# Altium schematic sheet relay.SchDoc
size A4
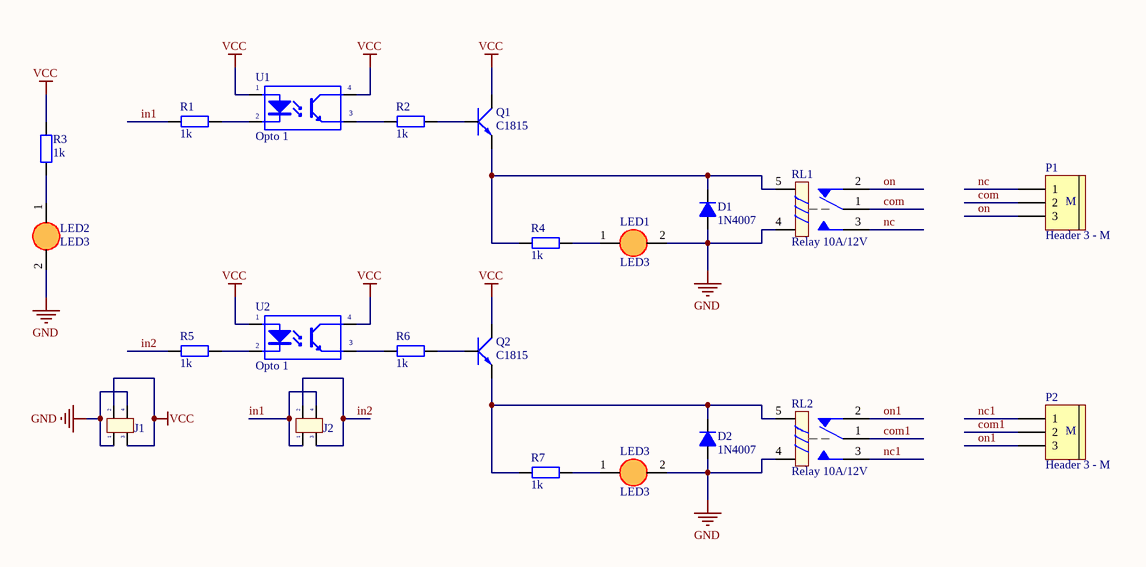
[diagram p0: relay.SchDoc]

## Parts
D1  1N4007  [D1A]
D2  1N4007  [D1A]
J1  Jumper 2x2  [JP2X2]  (value not drawn)
J2  Jumper 2x2  [JP2X2]  (value not drawn)
LED1  LED3  [LED3mm]
LED2  LED3  [LED3mm]
LED3  LED3  [LED3mm]
P1  Header 3 - M  [Medium - Header 3]
P2  Header 3 - M  [Medium - Header 3]
Q1  C1815  [QTO-92]
Q2  C1815  [QTO-92]
R1  1k  [R1/4W]
R2  1k  [R1/4W]
R3  1k  [R1/4W]
R4  1k  [R1/4W]
R5  1k  [R1/4W]
R6  1k  [R1/4W]
R7  1k  [R1/4W]
RL1  Relay 10A/12V  [RL_SPDT_10A]
RL2  Relay 10A/12V  [RL_SPDT_10A]
U1  Opto 1  [DIP4]
U2  Opto 1  [DIP4]

## Nets
GND: D1.1(A) D2.1(A) J1.1 J1.4 LED1.2(K) LED2.2(K) LED3.2(K) RL1.4 RL2.4
VCC: J1.2 J1.3 Q1.2(C) Q2.2(C) R3.1 U1.1(A) U1.4(C) U2.1(A) U2.4(C)
com: P1.2 RL1.1
com1: P2.2 RL2.1
in1: J2.1 J2.4 R1.1
in2: J2.2 J2.3 R5.1
nc: P1.1 RL1.3
nc1: P2.1 RL2.3
on: P1.3 RL1.2
on1: P2.3 RL2.2
NetD1_2: D1.2(K) Q1.1(E) R4.1 RL1.5
NetD2_2: D2.2(K) Q2.1(E) R7.1 RL2.5
NetLED1_1: LED1.1(A) R4.2
NetLED2_1: LED2.1(A) R3.2
NetLED3_1: LED3.1(A) R7.2
NetQ1_3: Q1.3(B) R2.2
NetQ2_3: Q2.3(B) R6.2
NetR1_2: R1.2 U1.2(K)
NetR2_1: R2.1 U1.3(E)
NetR5_2: R5.2 U2.2(K)
NetR6_1: R6.1 U2.3(E)

## Notes on the sheet
- (in symbol Header 3 - M) M

## Library data of the parts
D1 D2 = D1A: Diode 1A; Value: 1N4007
J1 J2 = JP2x2: Value: JP 2x2
LED1-LED3 = LED 3mm
P1 P2 = Header 3 - M: Header, 3-Pin, Medium; LatestRevisionDate: 17-Jul-2002; LatestRevisionNote: Re-released for DXP Platform.; Publisher: Altium Limited
Q1 Q2 = C1815: NPN 600mW, ECB; Value: C1815
R1-R7 = R1/4W: Resistor 1/4W; Value: R1/4W - 1K
RL1 RL2 = Relay 1: Relay SPDT,10A - 12VDC 5 Pin; Value: Relay SPDT, 10A, 12V
U1 U2 = Opto 1: Single; Value: TLP5211